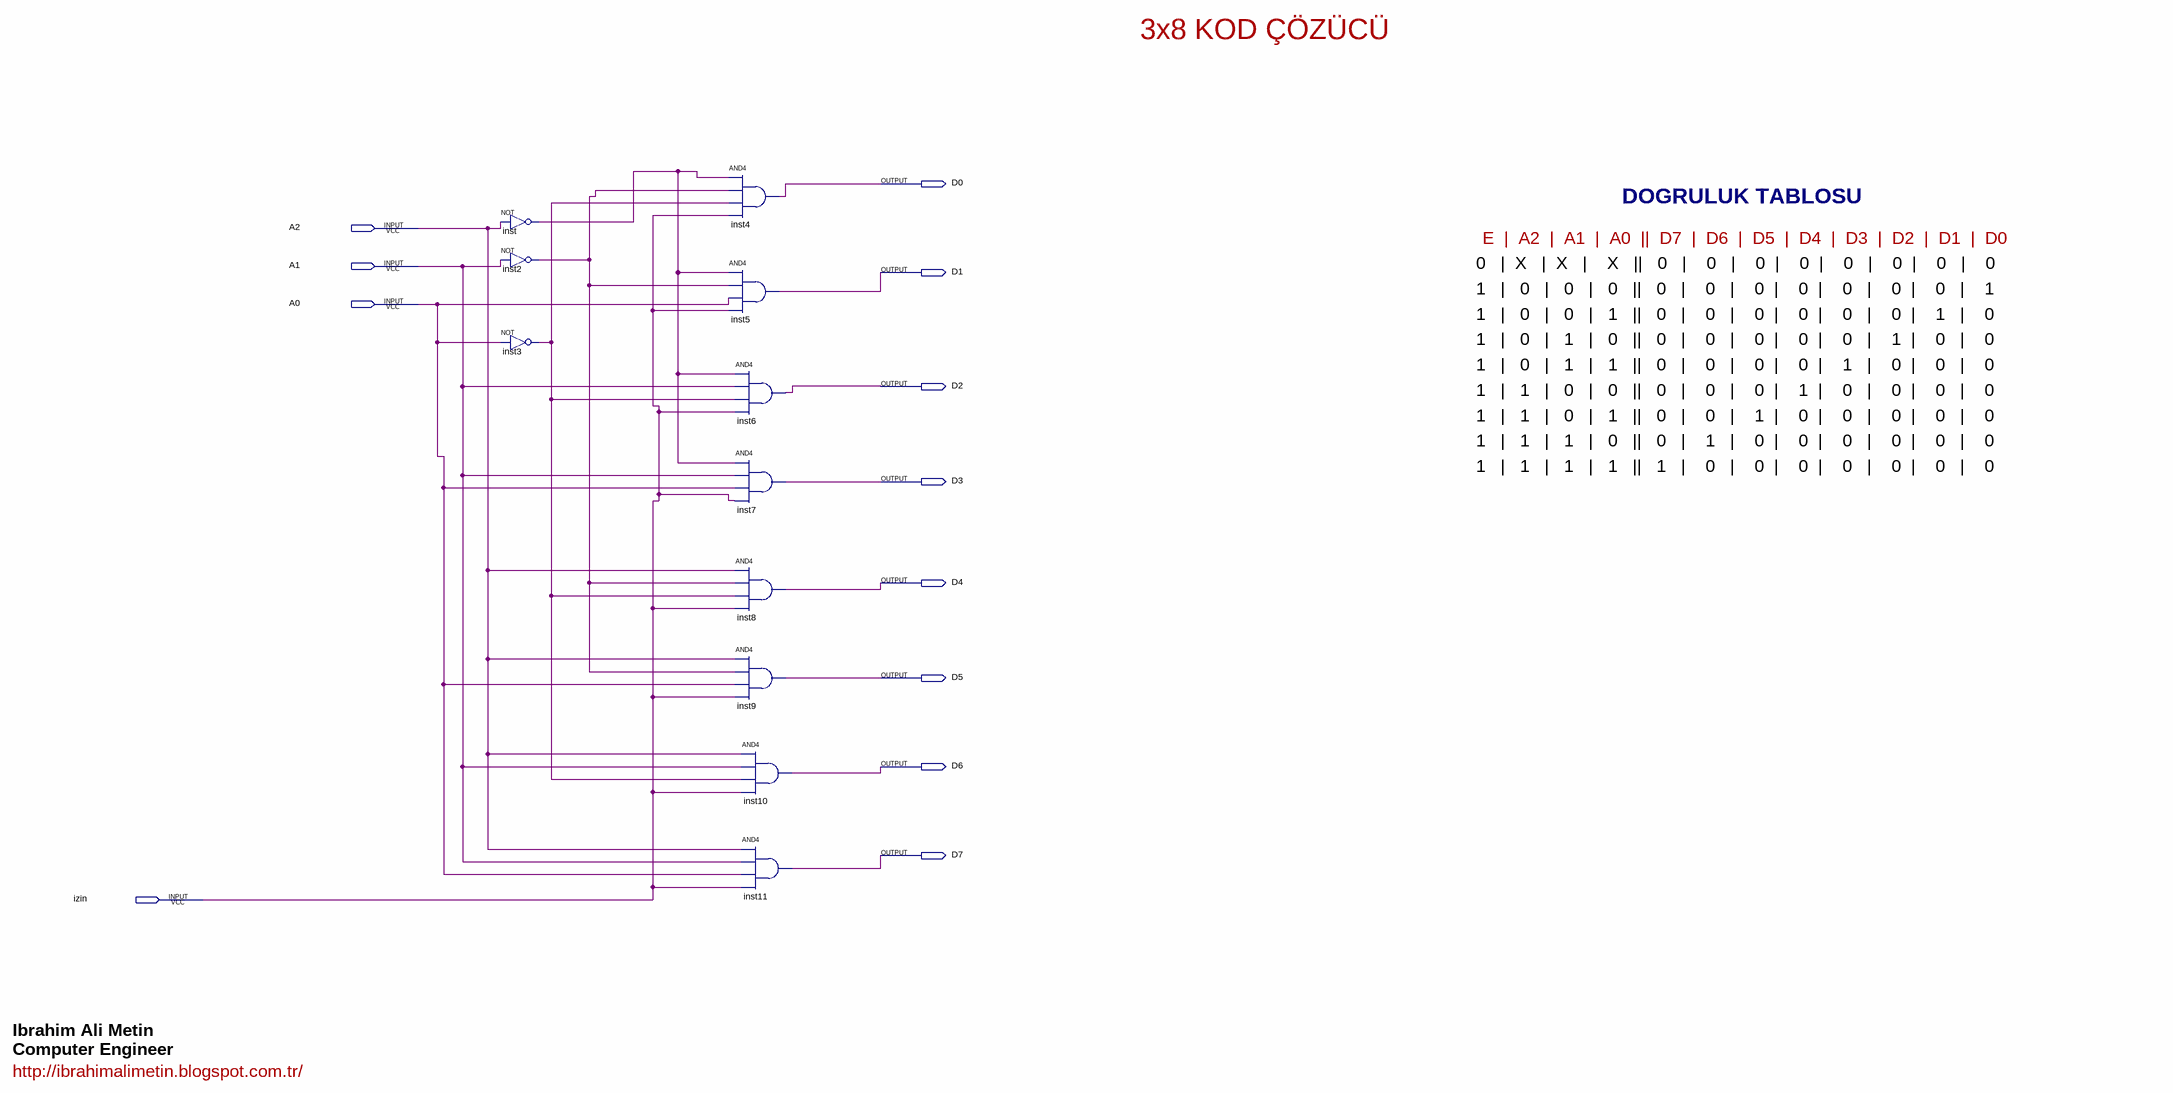
[diagram p0: schematic sheet]
// Quartus schematic kodcozucu.bdf as structural Verilog: 11 symbols, 12 pins
module kodcozucu (
  input  A2,
  input  A1,
  input  A0,
  input  izin,
  output D0,
  output D1,
  output D2,
  output D3,
  output D4,
  output D5,
  output D6,
  output D7
);

  wire inst2_out, inst3_out, inst_out;

  not inst (inst_out, A2);
  not inst2 (inst2_out, A1);
  not inst3 (inst3_out, A0);
  and inst4 (D0, inst_out, inst2_out, inst3_out, izin);
  and inst5 (D1, inst_out, inst2_out, A0, izin);
  and inst6 (D2, inst_out, A1, inst3_out, izin);
  and inst7 (D3, inst_out, A1, A0, izin);
  and inst8 (D4, A2, inst2_out, inst3_out, izin);
  and inst9 (D5, A2, inst2_out, A0, izin);
  and inst10 (D6, A2, A1, inst3_out, izin);
  and inst11 (D7, A2, A1, A0, izin);

  // Notes on the sheet:
  //   3x8 KOD ÇÖZÜCÜ
  //   DOGRULUK TABLOSU
  //   E  |  A2  |  A1  |  A0  ||  D7  |  D6  |  D5  |  D4  |  D3  |  D2  |  D1  |  D0
  //   0   |  X   |  X   |    X   ||   0   |    0   |    0  |    0  |    0   |    0  |    0   |    0
  //   1   |   0   |   0   |   0   ||   0   |    0   |    0  |    0  |    0   |    0  |    0   |    1
  //   1   |   0   |   0   |   1   ||   0   |    0   |    0  |    0  |    0   |    0  |    1   |    0
  //   1   |   0   |   1   |   0   ||   0   |    0   |    0  |    0  |    0   |    1  |    0   |    0
  //   1   |   0   |   1   |   1   ||   0   |    0   |    0  |    0  |    1   |    0  |    0   |    0
  //   1   |   1   |   0   |   0   ||   0   |    0   |    0  |    1  |    0   |    0  |    0   |    0
  //   1   |   1   |   0   |   1   ||   0   |    0   |    1  |    0  |    0   |    0  |    0   |    0
  //   1   |   1   |   1   |   0   ||   0   |    1   |    0  |    0  |    0   |    0  |    0   |    0
  //   1   |   1   |   1   |   1   ||   1   |    0   |    0  |    0  |    0   |    0  |    0   |    0
  //   Ibrahim Ali Metin
  //   Computer Engineer
  //   http://ibrahimalimetin.blogspot.com.tr/
endmodule
